# Altium schematic sheet USB.SchDoc
size A4
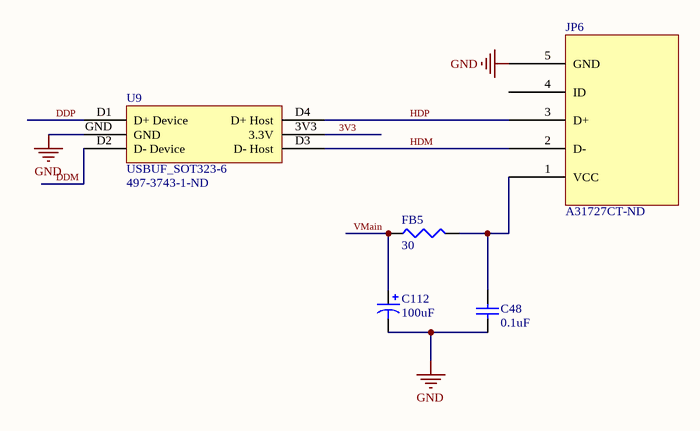
[diagram p0: USB.SchDoc]

## Parts
C48  value 0.1uF  [CAPC2008X06N]  (hidden comment: Kemet_0805_a_0.1uF)
C112  value 100uF  [6032]  (hidden comment: TantCap_6032_100uF)
FB5  Value @ 100MHz: 30  [0805]  (hidden comment: Murata_a_0805_30_Ohm_100Mhz)
JP6  Supplier Part Number 1: A31727CT-ND  [PCBComponent_1]  (hidden comment: Mini USB B)
U9  USBUF_SOT323-6  Supplier Part Number 1: 497-3743-1-ND  [SOT65P210X110-6N]

## Nets
GND: C48.1 C112.2 JP6.5(GND) U9.GND
3V3: U9.3V3(3.3V)
DDM: U9.D2(D-_Device)
DDP: U9.D1(D+_Device)
HDM: JP6.2(D-) U9.D3(D-_Host)
HDP: JP6.3(D+) U9.D4(D+_Host)
VMain: C112.1 FB5.1
NetC48_2: C48.2 FB5.2 JP6.1(VCC)

Not connected (* = marked no-connect by the designer): JP6 4(ID)

## Library data of the parts
C48 = Kemet_0805_a_0.1uF: CAP CER 0.1UF 50V 10% X7R 0805; Supplier 1: Digi-Key; Supplier Part Number 1: 399-1170-1-ND
C112 = TantCap_6032_100uF: CAP TANT 100UF 10V 10% LOESR SMD; Code_JEITA: 6032; ComponentLink1Description: Manufacturer Link; ComponentLink1URL: http://www.kemet.com; ComponentLink2Description: Datasheet; ComponentLink2URL: http://www.kemet.com/kemet/web/homepage/kechome.nsf/vapubfiles/B45197A_SpeedPower.pdf/$file/B45197A_SpeedPower.pdf; Supplier 1: Digi-Key; Supplier Part Number 1: 495-1528-1-ND
FB5 = Murata_a_0805_30_Ohm_100Mhz: FERRITE CHIP 30 OHM 3000MA 0805; Supplier 1: Digi-Key; Supplier Part Number 1: 490-1052-1-ND
JP6 = Mini USB B: Mini B USB Receptacle Type B; Supplier 1: Digi-Key
U9 = USBUF_SOT323-6: EMI FIlter and Line Termination for USB Upstream Ports; Manufacturer: ST Microelectronics; Supplier 1: Digi-Key